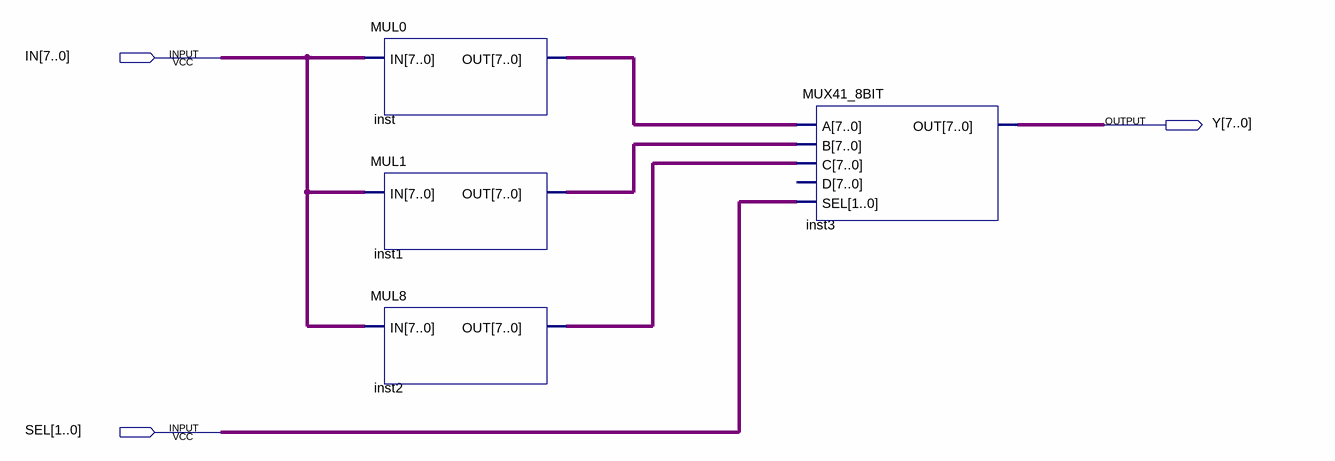
[diagram p0: schematic sheet]
// Quartus schematic MULTIPLY.bdf as structural Verilog: 4 symbols, 3 pins
module MULTIPLY (
  input  [7:0] IN,
  input  [1:0] SEL,
  output [7:0] Y
);

  wire [7:0] inst1_out, inst2_out, inst_out;

  MUL0 inst (.IN(IN), .OUT(inst_out));
  MUL1 inst1 (.IN(IN), .OUT(inst1_out));
  MUL8 inst2 (.IN(IN), .OUT(inst2_out));
  MUX41_8BIT inst3 (.A(inst_out), .B(inst1_out), .C(inst2_out), .SEL(SEL), .OUT(Y));  // open: D
endmodule
